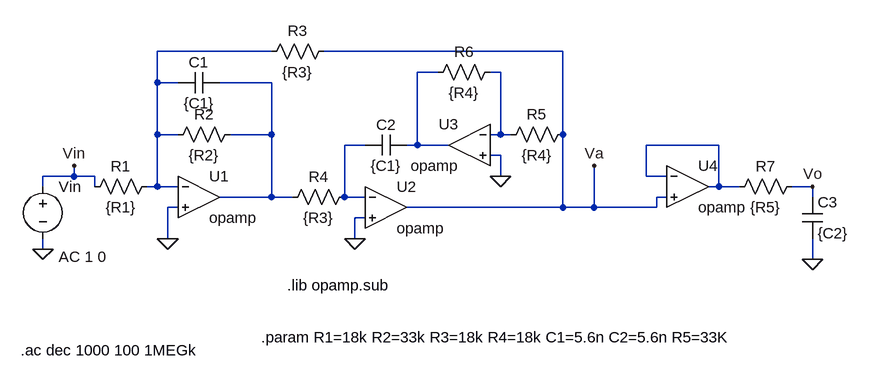
[diagram p0: schematic TC2_TPLAB1.asc]
TC2_TPLAB1.asc, the LTspice schematic file:
Version 4
SHEET 1 980 680
WIRE 80 0 -96 0
WIRE 528 0 160 0
WIRE 336 32 304 32
WIRE 432 32 416 32
WIRE -96 48 -96 0
WIRE -64 48 -96 48
WIRE 80 48 0 48
WIRE -96 128 -96 48
WIRE -64 128 -96 128
WIRE 80 128 80 48
WIRE 80 128 16 128
WIRE 432 128 432 32
WIRE 432 128 416 128
WIRE 448 128 432 128
WIRE 528 128 528 0
WIRE 224 144 192 144
WIRE 304 144 304 32
WIRE 304 144 288 144
WIRE 352 144 304 144
WIRE 768 144 656 144
WIRE 432 160 416 160
WIRE -224 192 -224 176
WIRE -224 192 -272 192
WIRE -192 192 -224 192
WIRE 432 192 432 160
WIRE 656 192 656 144
WIRE 688 192 656 192
WIRE -272 208 -272 192
WIRE -192 208 -192 192
WIRE -96 208 -96 128
WIRE -96 208 -112 208
WIRE -64 208 -96 208
WIRE 768 208 768 144
WIRE 768 208 752 208
WIRE 800 208 768 208
WIRE 912 208 880 208
WIRE 80 224 80 128
WIRE 80 224 0 224
WIRE 112 224 80 224
WIRE 192 224 192 144
WIRE 224 224 192 224
WIRE 688 224 672 224
WIRE 912 224 912 208
WIRE -64 240 -80 240
WIRE 528 240 528 128
WIRE 528 240 288 240
WIRE 576 240 576 176
WIRE 576 240 528 240
WIRE 672 240 672 224
WIRE 672 240 576 240
WIRE 224 256 208 256
WIRE -80 288 -80 240
WIRE 208 288 208 256
WIRE -272 304 -272 288
WIRE 912 320 912 288
FLAG -80 288 0
FLAG 208 288 0
FLAG 432 192 0
FLAG -272 304 0
FLAG 576 176 Va
FLAG -224 176 Vin
FLAG 912 320 0
FLAG 912 208 Vo
SYMBOL OpAmps\\opamp -32 160 R0
SYMATTR InstName U1
SYMBOL OpAmps\\opamp 256 176 R0
SYMATTR InstName U2
SYMBOL OpAmps\\opamp 384 80 M0
SYMATTR InstName U3
SYMBOL res 544 112 R90
WINDOW 0 0 56 VBottom 2
WINDOW 3 32 56 VTop 2
SYMATTR InstName R5
SYMATTR Value {R4}
SYMBOL res -96 192 R90
WINDOW 0 0 56 VBottom 2
WINDOW 3 32 56 VTop 2
SYMATTR InstName R1
SYMATTR Value {R1}
SYMBOL res 32 112 R90
WINDOW 0 0 56 VBottom 2
WINDOW 3 32 56 VTop 2
SYMATTR InstName R2
SYMATTR Value {R2}
SYMBOL res 176 -16 R90
WINDOW 0 0 56 VBottom 2
WINDOW 3 32 56 VTop 2
SYMATTR InstName R3
SYMATTR Value {R3}
SYMBOL res 208 208 R90
WINDOW 0 0 56 VBottom 2
WINDOW 3 32 56 VTop 2
SYMATTR InstName R4
SYMATTR Value {R3}
SYMBOL res 432 16 R90
WINDOW 0 0 56 VBottom 2
WINDOW 3 32 56 VTop 2
SYMATTR InstName R6
SYMATTR Value {R4}
SYMBOL cap 0 32 R90
WINDOW 0 0 32 VBottom 2
WINDOW 3 32 32 VTop 2
SYMATTR InstName C1
SYMATTR Value {C1}
SYMBOL cap 288 128 R90
WINDOW 0 0 32 VBottom 2
WINDOW 3 32 32 VTop 2
SYMATTR InstName C2
SYMATTR Value {C1}
SYMBOL voltage -272 192 R0
WINDOW 123 24 124 Left 2
WINDOW 39 0 0 Left 0
SYMATTR InstName Vin
SYMATTR Value ""
SYMATTR Value2 AC 1 0
SYMBOL OpAmps\\opamp 720 144 R0
SYMATTR InstName U4
SYMBOL res 896 192 R90
WINDOW 0 0 56 VBottom 2
WINDOW 3 32 56 VTop 2
SYMATTR InstName R7
SYMATTR Value {R5}
SYMBOL cap 896 288 M180
WINDOW 0 24 56 Left 2
WINDOW 3 24 8 Left 2
SYMATTR InstName C3
SYMATTR Value {C2}
TEXT 104 360 Left 2 !.lib opamp.sub
TEXT 64 440 Left 2 !.param R1=18k R2=33k R3=18k R4=18k C1=5.6n C2=5.6n R5=33K
TEXT -306 460 Left 2 !.ac dec 1000 100 1MEGk

The netlist it stands for:
* TC2_TPLAB1.asc
XU1 N001 0 N004 opamp Aol=100K GBW=10Meg  ; pins invin noninvin out
XU2 N005 0 Va opamp Aol=100K GBW=10Meg  ; pins invin noninvin out
XU3 N003 0 N002 opamp Aol=100K GBW=10Meg  ; pins invin noninvin out
R5 Va N003 {R4}
R1 N001 Vin {R1}
R2 N004 N001 {R2}
R3 Va N001 {R3}
R4 N005 N004 {R3}
R6 N003 N002 {R4}
C1 N004 N001 {C1}
C2 N002 N005 {C1}
Vin Vin 0 AC 1 0
XU4 N006 Va N006 opamp Aol=100K GBW=10Meg  ; pins invin noninvin out
R7 Vo N006 {R5}
C3 0 Vo {C2}
.lib opamp.sub
.param R1=18k R2=33k R3=18k R4=18k C1=5.6n C2=5.6n R5=33K
.ac dec 1000 100 1MEGk
.backanno
.end

* Results of the author's LTspice run, read from the files saved beside the schematic
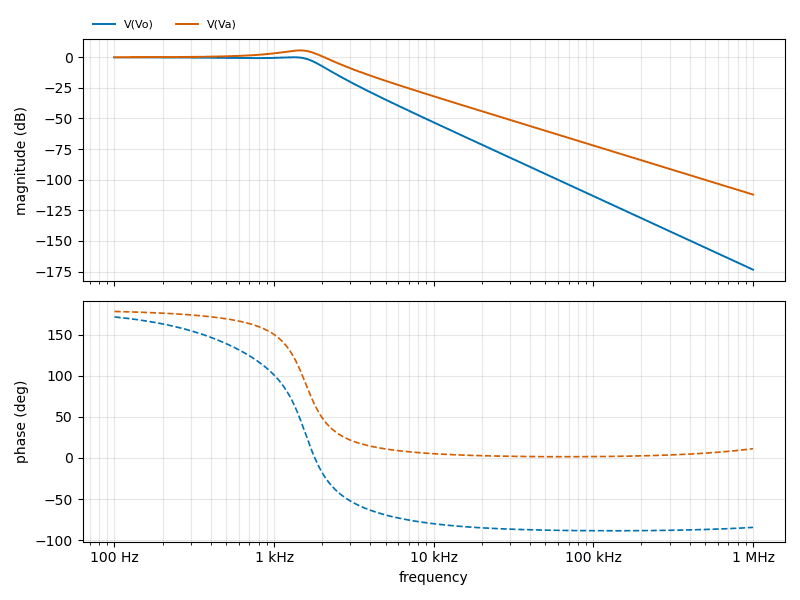
[diagram p1: AC Analysis of TC2_TPLAB1.asc, plotted from the saved traces]
* AC Analysis, 1 run:
*   V(Vo): -0.03 dB at 100 Hz, -173.49 dB at 1 MHz, peak -0.00 dB at 1.324 kHz, 3 dB below the peak at 1.73 kHz
*   V(Va): 0.03 dB at 100 Hz, -112.15 dB at 1 MHz, peak 5.60 dB at 1.455 kHz, 3 dB below the peak at 901.7 Hz and 1.852 kHz